# EAGLE schematic Rover Optical Dust Sensor (EAGLE 7.1.0)
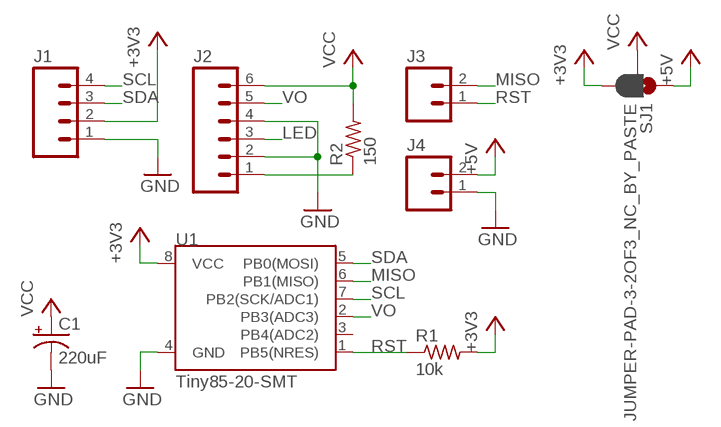
[diagram p0: schematic, sheet 1]

## Parts
C1  220uF  CAP_POLPTH1  [CPOL-RADIAL-100UF-25V]
J1  1X04M-0.1-PTH  [M-1X04-0.1-PTH]
J2  1X06M-0.1-PTH  [M-1X06-0.1-PTH]
J3  1X02M-0.1-PTH  [M-1X02-0.1-PTH]
J4  1X02M-0.1-PTH  [M-1X02-0.1-PTH]
R1  10k  RESISTOR0603  [R0603]
R2  150  RESISTOR0603  [R0603]
SJ1  JUMPER-PAD-3-2OF3_NC_BY_PASTE  [PAD-JUMPER-3-2OF3_NC_BY_PASTE_YES_SILK_FULL_BOX]
U1  Tiny85-20-SMT  ATTINY45TINY85-20-SMT  [SO08-EIAJ]

## Nets
+3V3: J1.2 R1.2 SJ1.3 U1.8(VCC)
+5V: J4.2 SJ1.1
GND: C1.2(-) J1.1 J2.2 J2.4 J4.1 U1.4(GND)
LED: J2.3
MISO: J3.2 U1.6(PB1(MISO))
N$1: J2.1 R2.1
RST: J3.1 R1.1 U1.1(PB5(NRES))
SCL: J1.4 U1.7(PB2(SCK/ADC1))
SDA: J1.3 U1.5(PB0(MOSI))
VCC: C1.1(+) J2.6 R2.2 SJ1.2
VO: J2.5 U1.2(PB3(ADC3))
Unconnected: U1.3(PB4(ADC2))

## Library data of the parts
C1 = SparkFun-Passives:CAP_POL: Capacitor Polarized These are standard SMD and PTH capacitors. Normally 10uF, 47uF, and 100uF in electrolytic and tantalum varieties. Always verify the external diameter of the through hole cap, it varies with capacity, voltage, and manufacturer. The EIA devices should be standard.
J1 = Jordi:1X04
J2 = Jordi:1X06
J3 J4 = Jordi:1X02
R1 R2 = Jordi:RESISTOR
SJ1 = SparkFun-Passives:JUMPER-PAD-3-2OF3_NC_BY_PASTE
U1 = SparkFun-DigitalIC:ATTINY45: Atmel 8-pin 2/4/8kB flash uC; PROD_ID: IC-09092